# EasyEDA Pro project 测试用电池架.epro

# Schematic schematic1
Create Date: 2024-03-11; Page Name: P1; Project Name: TB47测试用电池架; Schematic Name: schematic1; Update Date: 2024-03-11; Company: 嘉立创EDA; Page Size: A2; Version: V1.0
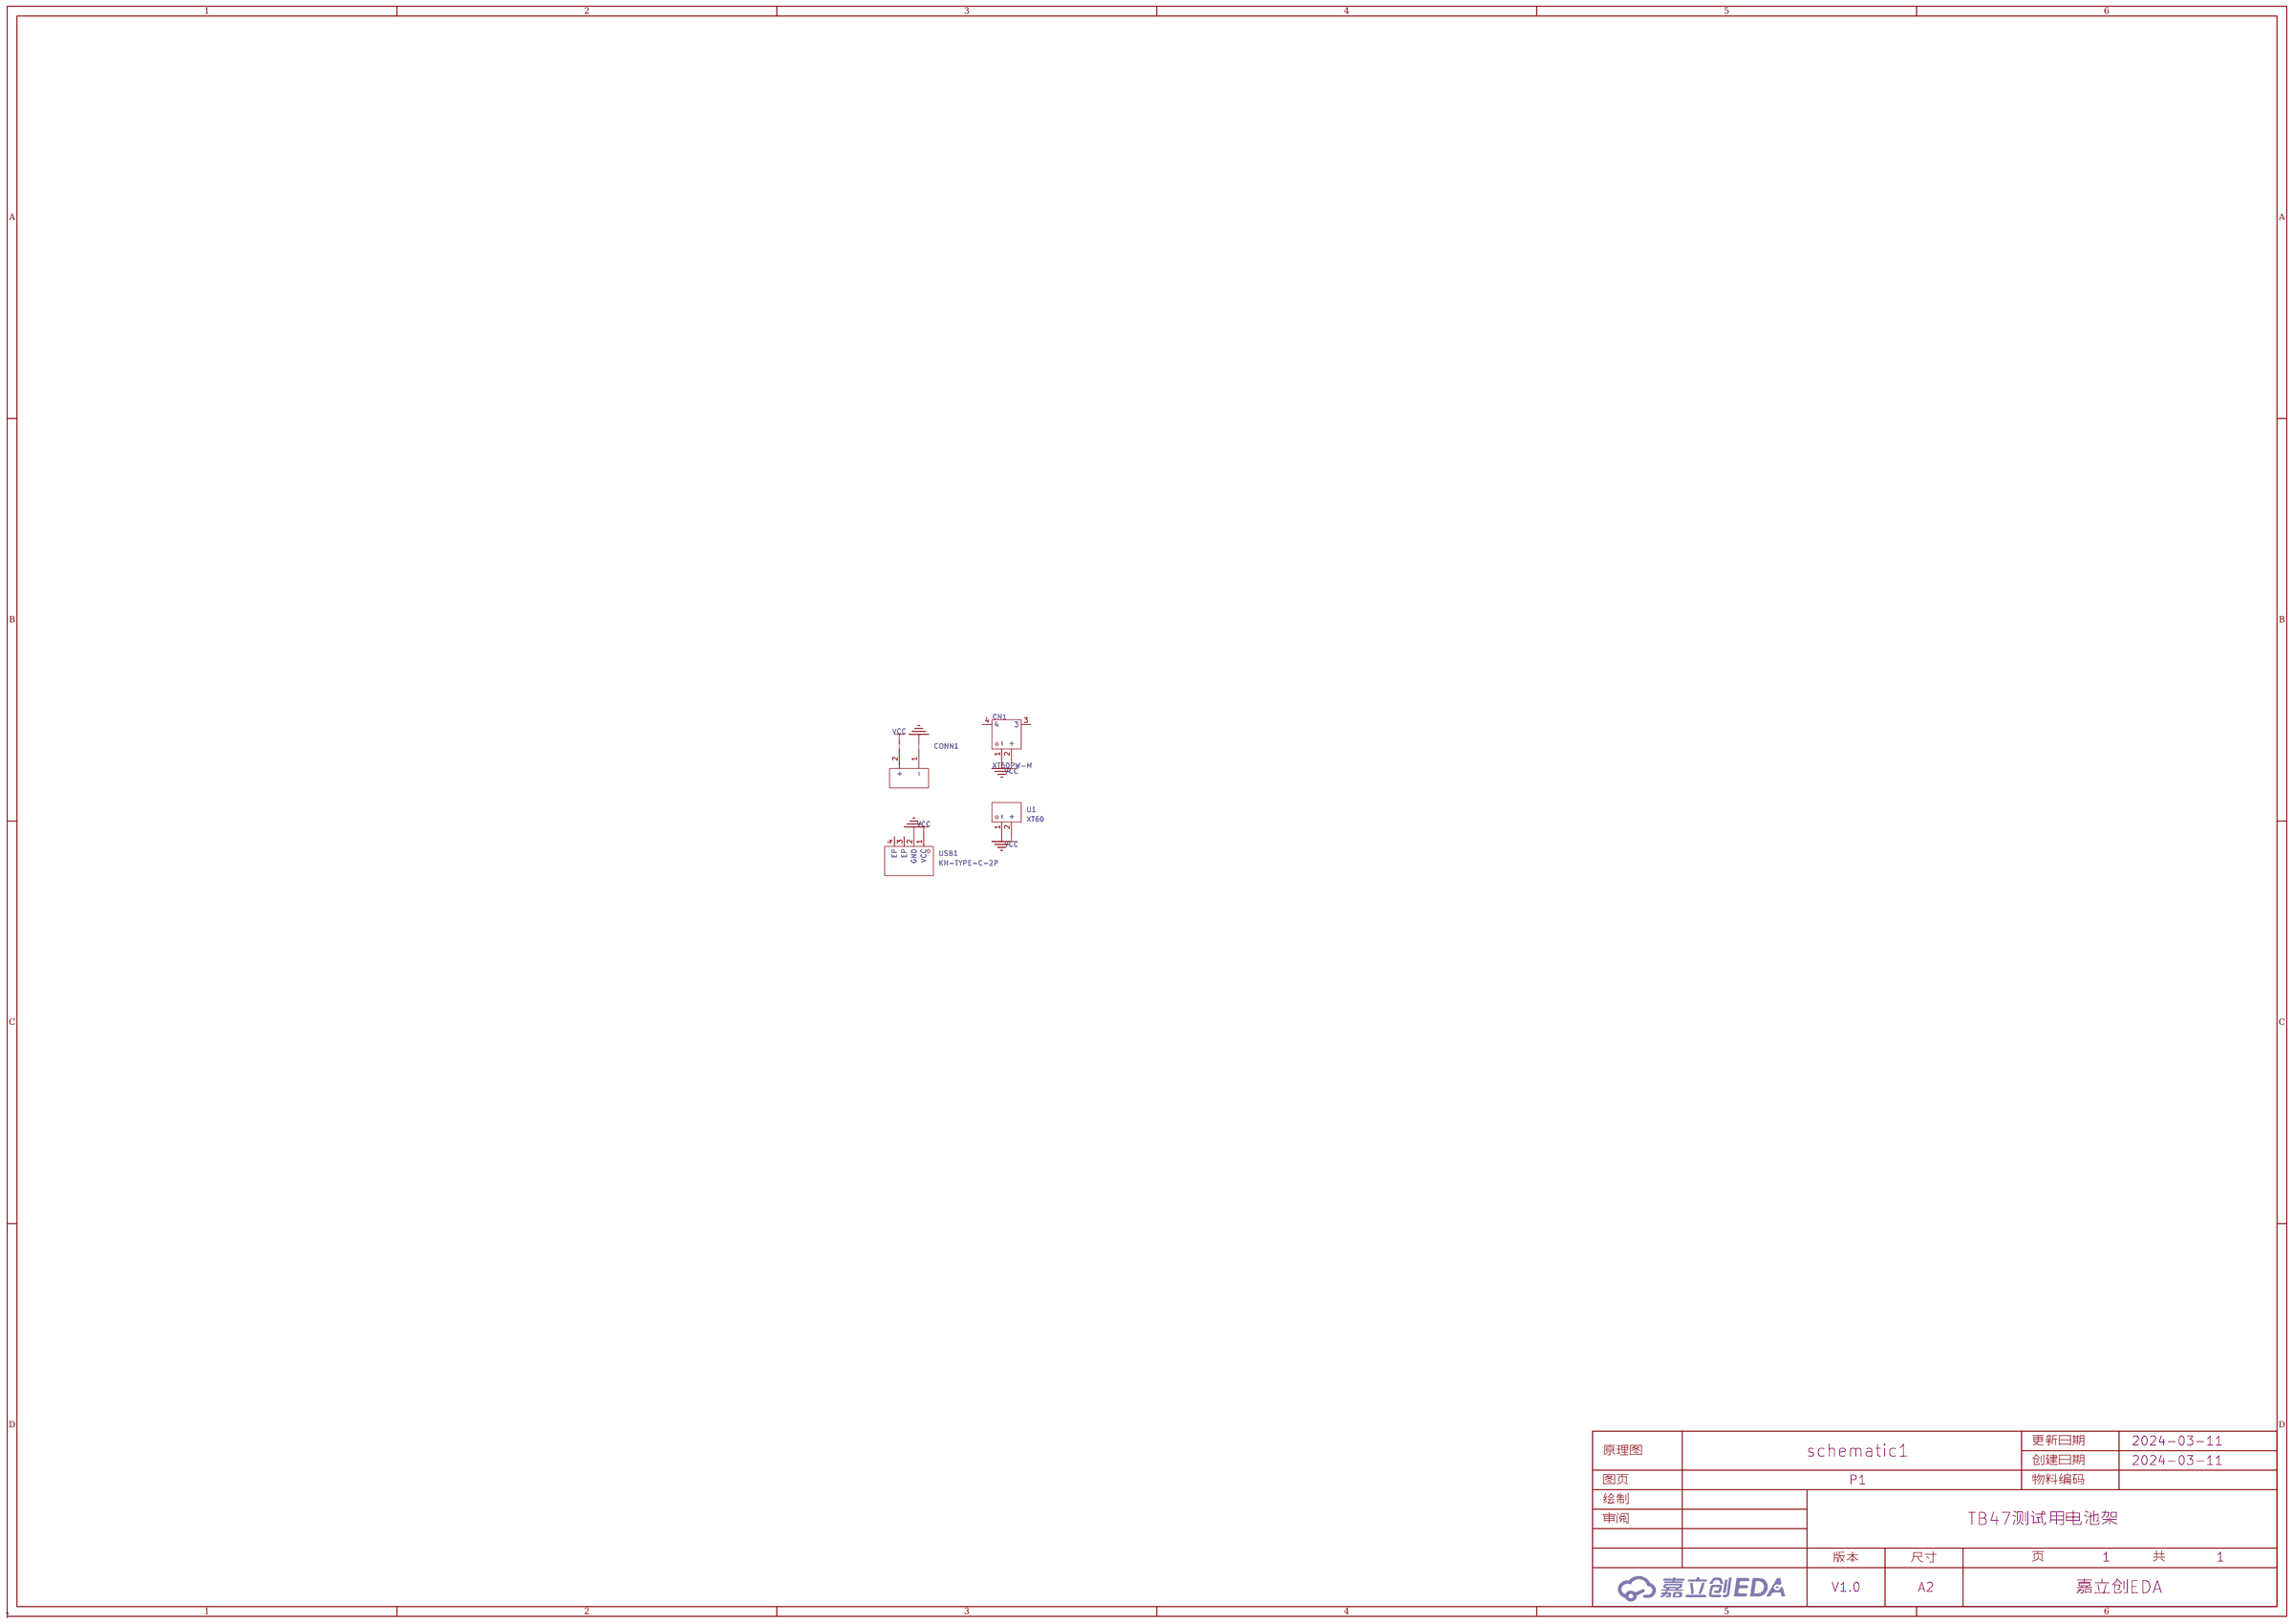
[diagram p0: schematic sheet]

## Parts
CN1  XT60PW-M  [CONN-TH_XT60PW-M]
CONN1  -  [TB47金手指]
U1  XT60  [CONN-TH_XT60]
USB1  KH-TYPE-C-2P  [USB-SMD_KH-TYPE-C-2P]

## Library data of the parts
CN1 = XT60PW-M: 类别:-;类型1:-;; LCSC Part Name: AMASS(艾迈斯)航模插头xt60连接器150公母对接pw锂电池公头 板插卧式XT60PW-M; Supplier Part: C98732; Manufacturer: AMASS(艾迈斯); JLCPCB Part Class: Extended Part; Datasheet: https://atta.szlcsc.com/upload/public/pdf/source/20240118/44A3DCFF53BE25DC65378AFFB21277A4.pdf; Supplier: LCSC; Brand: 艾迈斯; Type: 卧式插头; Colour: 黄色; InterfaceType: 公头
CONN1 = TB47金手指
U1 = XT60: 类别:-;类型1:-;; LCSC Part Name: AMASS(艾迈斯) XT60模型插头 3.5mm镀金香蕉头公头（电调端）XT60-M; Supplier Part: C98733; Manufacturer: AMASS(艾迈斯); JLCPCB Part Class: Extended Part; Datasheet: https://atta.szlcsc.com/upload/public/pdf/source/20170606/1496716524919.pdf; Supplier: LCSC; Brand: 艾迈斯; Type: 香蕉头; Colour: 黄色; InterfaceType: 公头; specifications: 3.5mm
USB1 = KH-TYPE-C-2P: 连接器类型:Type-C;标准:-;公母:-;端口数量:-;触点数量:2P;安装方式:-;额定电流 - 电源:-;触头材质:-;触头镀层:-;工作温度范围:-;; LCSC Part Name: Type-C; Supplier Part: C2919656; Manufacturer: kinghelm(金航标); Supplier Footprint: 插件; JLCPCB Part Class: Extended Part; Datasheet: https://atta.szlcsc.com/upload/public/pdf/source/20220707/620587A9E0589B27D96D3CEE595CBC98.pdf; Supplier: LCSC; Connector Type: Type-C; Number of Contacts: 2P

## Nets
GND: CN1.1(-) CONN1.1(-) U1.1(-) USB1.2(GND)
VCC: CN1.2(+) CONN1.2(+) U1.2(+) USB1.1(VCC)

Not connected (* = marked no-connect by the designer): CN1 3 4; USB1 3(EP) 4(EP)

# Board PCB1
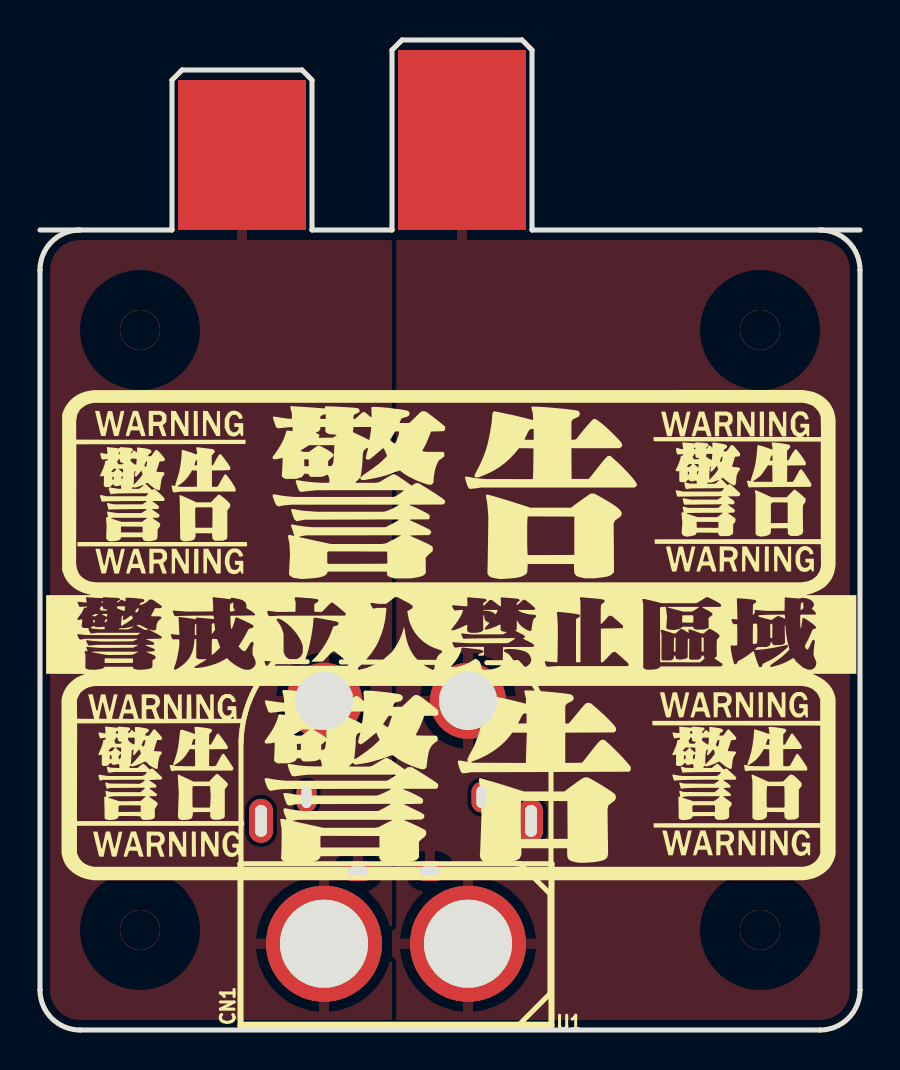
[diagram p1: board, top side]
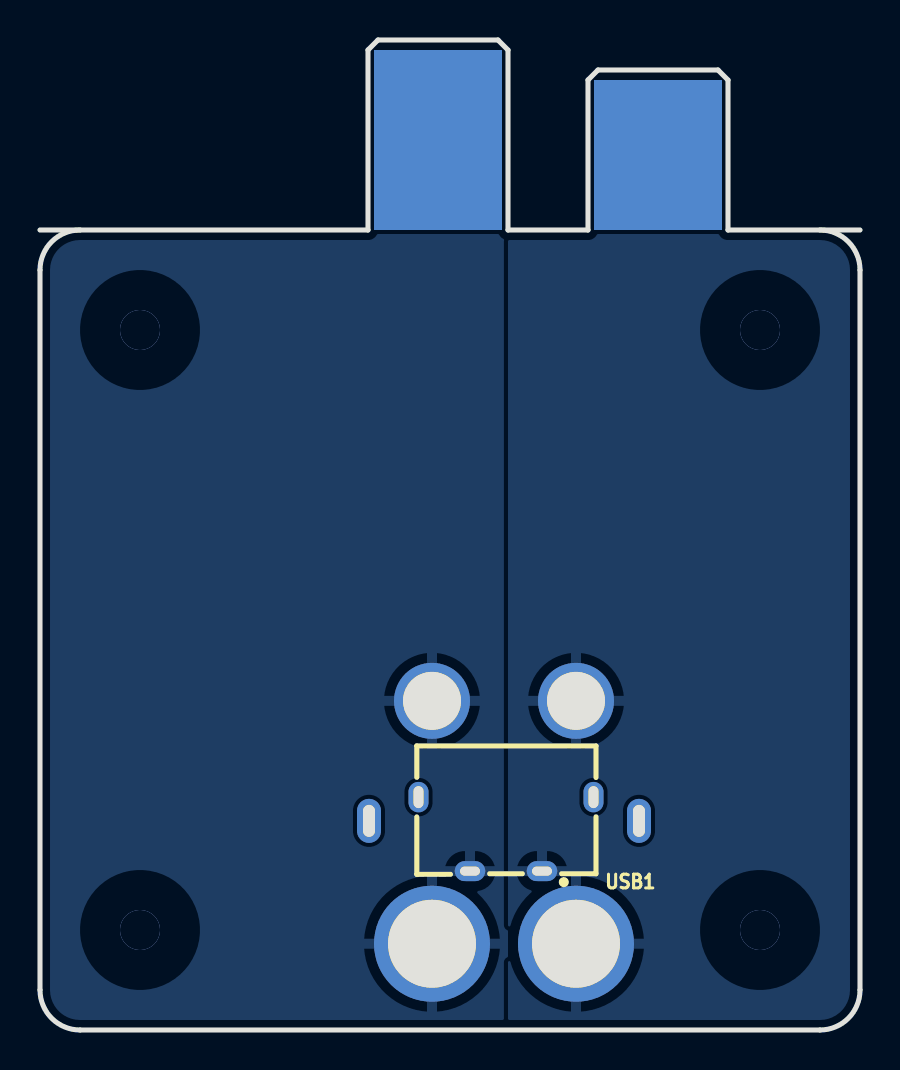
[diagram p2: board, bottom side, seen from below]

Outline 41 x 49.5 mm; copper layers: Top Layer, Bottom Layer. Coordinates in mm from the lower left corner of the outline.
Outline path: 2,40 arc(0.59,39.41) 0,38 0,2 arc(0.59,0.59) 2,0 39,0 arc(40.41,0.59) 41,2 41,38 arc(40.41,39.41) 39,40
Stack: Top Layer 0.035mm / Dielectric1 1.51mm FR4 er 4.5 / Bottom Layer 0.035mm

## Design rules (mm)
template: 我的配置
spacing copperThickness1oz (default): track to track 0.102, other pairs 0.152 to 0.3
spacing copperThickness2oz: track to track 0.203, other pairs 0.152 to 0.3
track width copperThickness1oz (default): min 0.127, default 0.254, max 2.54
track width copperThickness2oz: min 0.203, default 0.254, max 2.54
differential pair differentialPair (default): width min 0.127, default 0.254, max 2.54; gap min 0.152, default 0.152
via viaSize (default): diameter min 0.457, default 0.457, max 10; hole min 0.203, default 0.203, max 6.299
net GND uses 全连接
net VCC uses 全连接

## Placement (name value [footprint] x y rotation side)
CN1  XT60PW-M  [CONN-TH_XT60PW-M]  17.8 13.46 90 top
CONN1  -  [TB47金手指]  20.5 40 0 top
U1  XT60  [CONN-TH_XT60]  17.8 4.31 180 top
USB1  KH-TYPE-C-2P  [USB-SMD_KH-TYPE-C-2P]  17.7 9.79 0 bottom

## Footprints (pads in the part's own frame, mm; a bottom-side part is the same pattern mirrored in y, then rotated)
CONN-TH_XT60
  round 5.8 hole 4.4: 1(-3.6,0) 2(3.6,0)
CONN-TH_XT60PW-M
  round 3.8 hole 2.9: 1(3,-3.6) 2(3,3.6)
  oval 2.2x1.2 hole 1.6x0.6: 3(-3,6.75) 4(-3,-6.75)
TB47金手指
  rect 6.4x9 smd: 1(0.6,4.5)
  rect 6.4x9 smd far side: 1(0.6,4.5)
  rect 6.4x7.5 smd: 2(-10.4,3.75)
  rect 6.4x7.5 smd far side: 2(-10.4,3.75)
USB-SMD_KH-TYPE-C-2P
  oval 1.524x1 hole 1x0.45: 1(-1.8,1.85) 2(1.8,1.85)
  oval 1x1.524 hole 0.5x1.1: 3(4.375,-1.85) 4(-4.375,-1.85)

## Nets
As in the schematic.

Pads without a net: CN1 3 4; USB1 3 4

## Via types
v1: diameter 2, hole 3.2, Top Layer to Bottom Layer, 4 vias

## Routing (per net, layer and track width the routed paths; a pad name or vN(x,y) marks a point on that pad's centre or on a via; arc(x,y) is an arc through that point)
GND:
  vias: v1(36,35) v1(36,5)
VCC:
  vias: v1(5,35) v1(5,5)

## Copper pours and planes (outline as drawn; the poured copper is in the pictures)
GND on Top Layer: 17.6,49 45.26,49 45.26,-3.69 17.6,-3.69
GND on Bottom Layer: 17.6,49 54.03,49 54.03,-12.96 17.6,-12.96
VCC on Top Layer: -5.79,49 17.6,49 17.6,-6.1 -5.79,-6.1
VCC on Bottom Layer: -12.39,49 17.6,49 17.6,-7.37 -12.39,-7.37

## Text on the board
Document Layer: 使用1.2板厚进行打板
